# EAGLE design esp07_4PIO_6S_v2 (EAGLE 7.4.0)
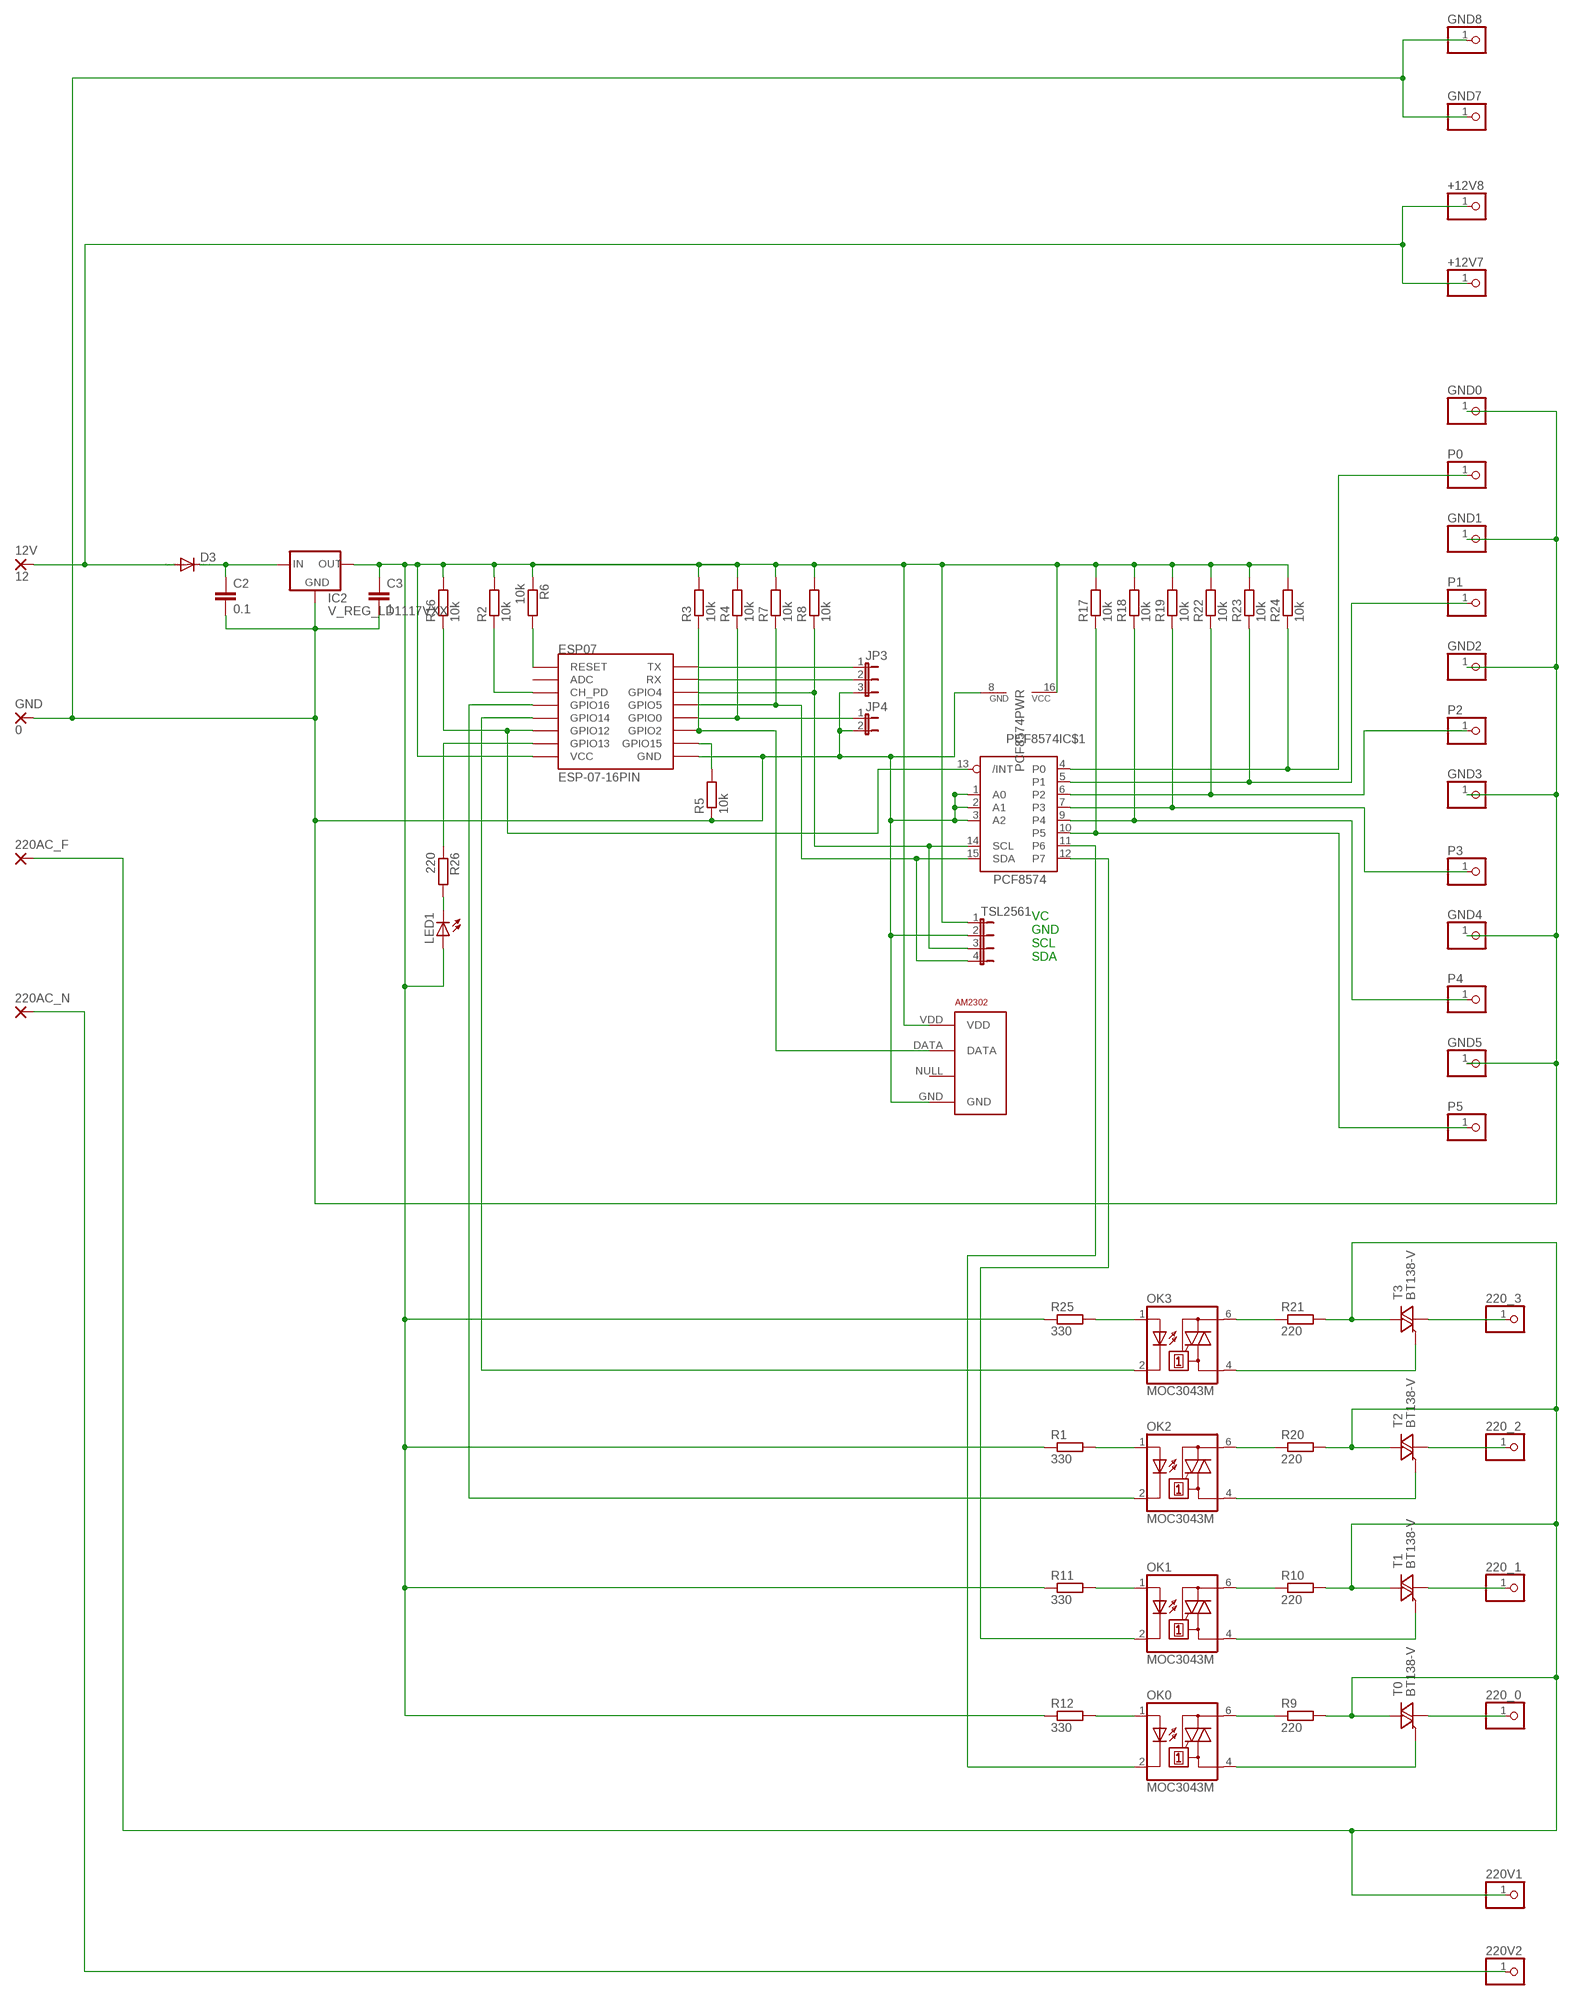
[diagram p0: schematic, sheet 1]

## Parts
12V  12  2,54/0,9  [2,54/0,9]
220_0  PINHD-1X1  [1X01]
220_1  PINHD-1X1  [1X01]
220_2  PINHD-1X1  [1X01]
220_3  PINHD-1X1  [1X01]
220AC_F  1,6/0,9  [1,6/0,9]
220AC_N  1,6/0,9  [1,6/0,9]
220V1  PINHD-1X1  [1X01]
220V2  PINHD-1X1  [1X01]
+12V7  PINHD-1X1  [1X01]
+12V8  PINHD-1X1  [1X01]
AM2302  RHT03_DHT-22_AM2302WIRED  [AM2302]
C2  0.1  C-EUC0805  [C0805]
C3  1  C-EUC1206  [C1206]
D3  DIODE-SOD80C  [SOD80C]
ESP07  ESP-07-16PIN  [ESP-07-16PIN]
GND  0  2,54/0,9  [2,54/0,9]
GND0  PINHD-1X1  [1X01]
GND1  PINHD-1X1  [1X01]
GND2  PINHD-1X1  [1X01]
GND3  PINHD-1X1  [1X01]
GND4  PINHD-1X1  [1X01]
GND5  PINHD-1X1  [1X01]
GND7  PINHD-1X1  [1X01]
GND8  PINHD-1X1  [1X01]
IC2  V_REG_LD1117VXX  [78XXL]
JP3  JP2E  [JP2]
JP4  JP1E  [JP1]
LED1  LEDCHIPLED_1206  [CHIPLED_1206]
OK0  MOC3043M  [DIL06]
OK1  MOC3043M  [DIL06]
OK2  MOC3043M  [DIL06]
OK3  MOC3043M  [DIL06]
P0  PINHD-1X1  [1X01]
P1  PINHD-1X1  [1X01]
P2  PINHD-1X1  [1X01]
P3  PINHD-1X1  [1X01]
P4  PINHD-1X1  [1X01]
P5  PINHD-1X1  [1X01]
PCF8574  PCF8574  [SOP16]
R1  330  R-EU_M1206  [M1206]
R2  10k  R-EU_R1206  [R1206]
R3  10k  R-EU_R1206  [R1206]
R4  10k  R-EU_R1206  [R1206]
R5  10k  R-EU_R1206  [R1206]
R6  10k  R-EU_R1206  [R1206]
R7  10k  R-EU_R1206  [R1206]
R8  10k  R-EU_R1206  [R1206]
R9  220  R-EU_M1206  [M1206]
R10  220  R-EU_M1206  [M1206]
R11  330  R-EU_M1206  [M1206]
R12  330  R-EU_M1206  [M1206]
R16  10k  R-EU_R1206  [R1206]
R17  10k  R-EU_R1206  [R1206]
R18  10k  R-EU_R1206  [R1206]
R19  10k  R-EU_R1206  [R1206]
R20  220  R-EU_M1206  [M1206]
R21  220  R-EU_M1206  [M1206]
R22  10k  R-EU_R1206  [R1206]
R23  10k  R-EU_R1206  [R1206]
R24  10k  R-EU_R1206  [R1206]
R25  330  R-EU_M1206  [M1206]
R26  220  R-EU_M1206  [M1206]
T0  BT138-V  [TO220BV]
T1  BT138-V  [TO220BV]
T2  BT138-V  [TO220BV]
T3  BT138-V  [TO220BV]
TSL2561  JP4E  [JP4]

## Nets
200V: 220AC_F.1(P) 220V1.1 R9.2 R10.2 R20.2 R21.2 T0.T2(A2) T1.T2(A2) T2.T2(A2) T3.T2(A2)
N$1: 12V.1(P) +12V7.1 +12V8.1 D3.A
N$3: OK3.1(A) R25.2
N$4: P0.1 PCF8574.4(IC$1:P0) R24.1
N$5: ESP07.TX JP3.1
N$6: ESP07.RX JP3.2
N$7: P1.1 PCF8574.5(IC$1:P1) R23.1
N$8: OK1.2(C) PCF8574.12(IC$1:P7)
N$9: P2.1 PCF8574.6(IC$1:P2) R22.1
N$10: ESP07.GPIO13 R26.1
N$11: ESP07.CH_PD R2.1
N$12: ESP07.REST(RESET) R6.2
N$13: P3.1 PCF8574.7(IC$1:P3) R19.1
N$14: OK0.2(C) PCF8574.11(IC$1:P6)
N$15: P4.1 PCF8574.9(IC$1:P4) R18.1
N$16: P5.1 PCF8574.10(IC$1:P5) R17.1
N$18: LED1.C R26.2
N$19: ESP07.GPIO14 OK3.2(C)
N$20: OK2.1(A) R1.2
N$21: OK1.1(A) R11.2
N$22: OK1.6(A2) R10.1
N$23: OK0.6(A2) R9.1
N$24: OK1.4(A1) T1.G
N$25: C2.1 D3.C IC2.OUT(IN)
N$26: OK0.4(A1) T0.G
N$27: 220_1.1 T1.T1(A1)
N$29: ESP07.GPIO4 PCF8574.14(IC$1:SCL) R8.1 TSL2561.3
N$30: 220_2.1 T2.T1(A1)
N$31: 220_0.1 T0.T1(A1)
N$32: AM2302.VDD C3.1 ESP07.VCC IC2.GND(OUT) LED1.A PCF8574.16(PWR:VCC) R1.1 R2.2 R3.2 R4.2 R6.1 R7.2 R8.2 R11.1 R12.1 R16.2 R17.2 R18.2 R19.2 R22.2 R23.2 R24.2 R25.1 TSL2561.1
N$33: OK0.1(A) R12.2
N$35: OK3.6(A2) R21.1
N$36: OK2.6(A2) R20.1
N$37: OK3.4(A1) T3.G
N$38: OK2.4(A1) T2.G
N$39: 220_3.1 T3.T1(A1)
N$40: ESP07.GPIO16 OK2.2(C)
N$41: 220AC_N.1(P) 220V2.1
N$42: ESP07.GPIO5 PCF8574.15(IC$1:SDA) R7.1 TSL2561.4
N$44: AM2302.GND C2.2 C3.2 ESP07.GND GND0.1 GND1.1 GND2.1 GND3.1 GND4.1 GND5.1 GND7.1 GND8.1 GND.1(P) IC2.IN(GND) JP3.3 JP4.2 PCF8574.1(IC$1:A0) PCF8574.2(IC$1:A1) PCF8574.3(IC$1:A2) PCF8574.8(PWR:GND) R5.1 TSL2561.2
N$45: ESP07.GPIO15 R5.2
N$46: ESP07.GPIO0 JP4.1 R4.1
N$47: AM2302.DATA ESP07.GPIO2 R3.1
N$48: ESP07.GPIO12 PCF8574.13(IC$1:/INT) R16.1
Unconnected: AM2302.NULL ESP07.ADC

## Notes on the sheet
- VC
  GND
  SCL
  SDA

## Library data of the parts
12V GND = wirepad:2,54/0,9: THROUGH-HOLE PAD
220_0 220_1-220_3 220V1 220V2 +12V7 +12V8 GND0 GND1-GND5 GND7 GND8 P0 P1-P5 = pinhead:PINHD-1X1: PIN HEADER
220AC_F 220AC_N = wirepad:1,6/0,9: THROUGH-HOLE PAD
AM2302 = RHT03_DHT-22_AM2302:RHT03_DHT-22_AM2302: RHT03 / DHT-22 / AM2302 Packages and symbol for the RHT03 / DHT-22 relative humidity and temperature sensor. Note: The AM2302 is a wired version of the DHT-22 which typically requires less clearance and is thus provided as a separate package.; PROD_ID: SEN-10167
C2 C3 = rcl:C-EU: CAPACITOR, European symbol
D3 = diode:DIODE-: DIODE
ESP07 = esp8266modules:ESP-07-16PIN: ESP8266 Wifi Module ESP-07 - 16 pins; DIMENSIONS: 22.0 x 16.0 mm; PINS: 16; PITCH: 0.078" / 2 mm
IC2 = SparkFun:V_REG_LD1117VXX: LD1117VXX voltage regulator. We carry the 3.3V version (COM-00526) in TO-220 package.
JP3 = jumper:JP2E: JUMPER
JP4 = jumper:JP1E: JUMPER
LED1 = led:LED: LED OSRAM: - CHIPLED LG R971, LG N971, LY N971, LG Q971, LY Q971, LO R971, LY R971 LH N974, LH R974 LS Q976, LO Q976, LY Q976 LO Q996 - Hyper CHIPLED LW Q18S LB Q993, LB Q99A, LB R99A - SideLED LS A670, LO A670, LY A670, LG A670, LP A670 LB A673, LV A673, LT A673, LW A673 LH A674 LY A675 LS A676, LA A676, LO A676, LY A676, LW A676 LS A679, LY A679, LG A679 - Hyper Micro SIDELED® LS Y876, LA Y876, LO Y876, LY Y876 LT Y87S - SmartLED LW L88C, LW L88S LB L89C, LB L89S, LG L890 LS L89K, LO L89K, LY L89K LS L896, LA L896, LO L896, LY L896 - TOPLED LS T670, LO T670, LY T670, LG T670, LP T670 LSG T670, LSP T670, LSY T670, LOP T670, LYG T670 LG T671, LOG T671, LSG T671 LB T673, LV T673, LT T673, LW T673 LH T674 LS T676, LA T676, LO T676, LY T676, LB T676, LH T676, LSB T676, LW T676 LB T67C, LV T67C, LT T67C, LS T67K, LO T67K, LY T67K, LW E67C LS E67B, LA E67B, LO E67B, LY E67B, LB E67C, LV E67C, LT E67C LW T67C LS T679, LY T679, LG T679 LS T770, LO T770, LY T770, LG T770, LP T770 LB T773, LV T773, LT T773, LW T773 LH T774 LS E675, LA E675, LY E675, LS T675 LS T776, LA T776, LO T776, LY T776, LB T776 LHGB T686 LT T68C, LB T68C - Hyper Mini TOPLED® LB M676 - Mini TOPLED Santana® LG M470 LS M47K, LO M47K, LY M47K Source: http://www.osram.convergy.de LUXEON: - LUMILED® LXK2-PW12-R00, LXK2-PW12-S00, LXK2-PW14-U00, LXK2-PW14-V00 LXK2-PM12-R00, LXK2-PM12-S00, LXK2-PM14-U00 LXK2-PE12-Q00, LXK2-PE12-R00, LXK2-PE12-S00, LXK2-PE14-T00, LXK2-PE14-U00 LXK2-PB12-K00, LXK2-PB12-L00, LXK2-PB12-M00, LXK2-PB14-N00, LXK2-PB14-P00, LXK2-PB14-Q00 LXK2-PR12-L00, LXK2-PR12-M00, LXK2-PR14-Q00, LXK2-PR14-R00 LXK2-PD12-Q00, LXK2-PD12-R00, LXK2-PD12-S00 LXK2-PH12-R00, LXK2-PH12-S00 LXK2-PL12-P00, LXK2-PL12-Q00, LXK2-PL12-R00 Source: www.luxeon.com KINGBRIGHT: KA-3528ASYC Source: www.kingbright.com
OK0 OK1-OK3 = optocoupler:MOC30*: 6-Pin DIP Zero-Cross Optoisolators Triac Driver Output (250/400 Volt Peak) Source: Data sheet <http://www.fairchildsemi.com/ds/MO/MOC3031M.pdf> The old path of data sheet not more available 2013-05-06.; MF: FAIRCHILD SEMICONDUCTOR; MPN: MOC3043-M; OC_FARNELL: 1021371; OC_NEWARK: 72K8900
PCF8574 = i2c:PCF8574: Remote 8-Bit I/O Expander for I²C Bus
R1 R9-R12 R20 R21 R25 R26 = rcl:R-EU_: RESISTOR, European symbol
R2-R8 R16-R19 R22-R24 = resistor:R-EU_: RESISTOR, European symbol
T0 T1-T3 = triac:BT138: TRIAC Source: http://www.semiconductors.philips.com BT138_SERIES_2.pdf
TSL2561 = jumper:JP4E: JUMPER

## Board
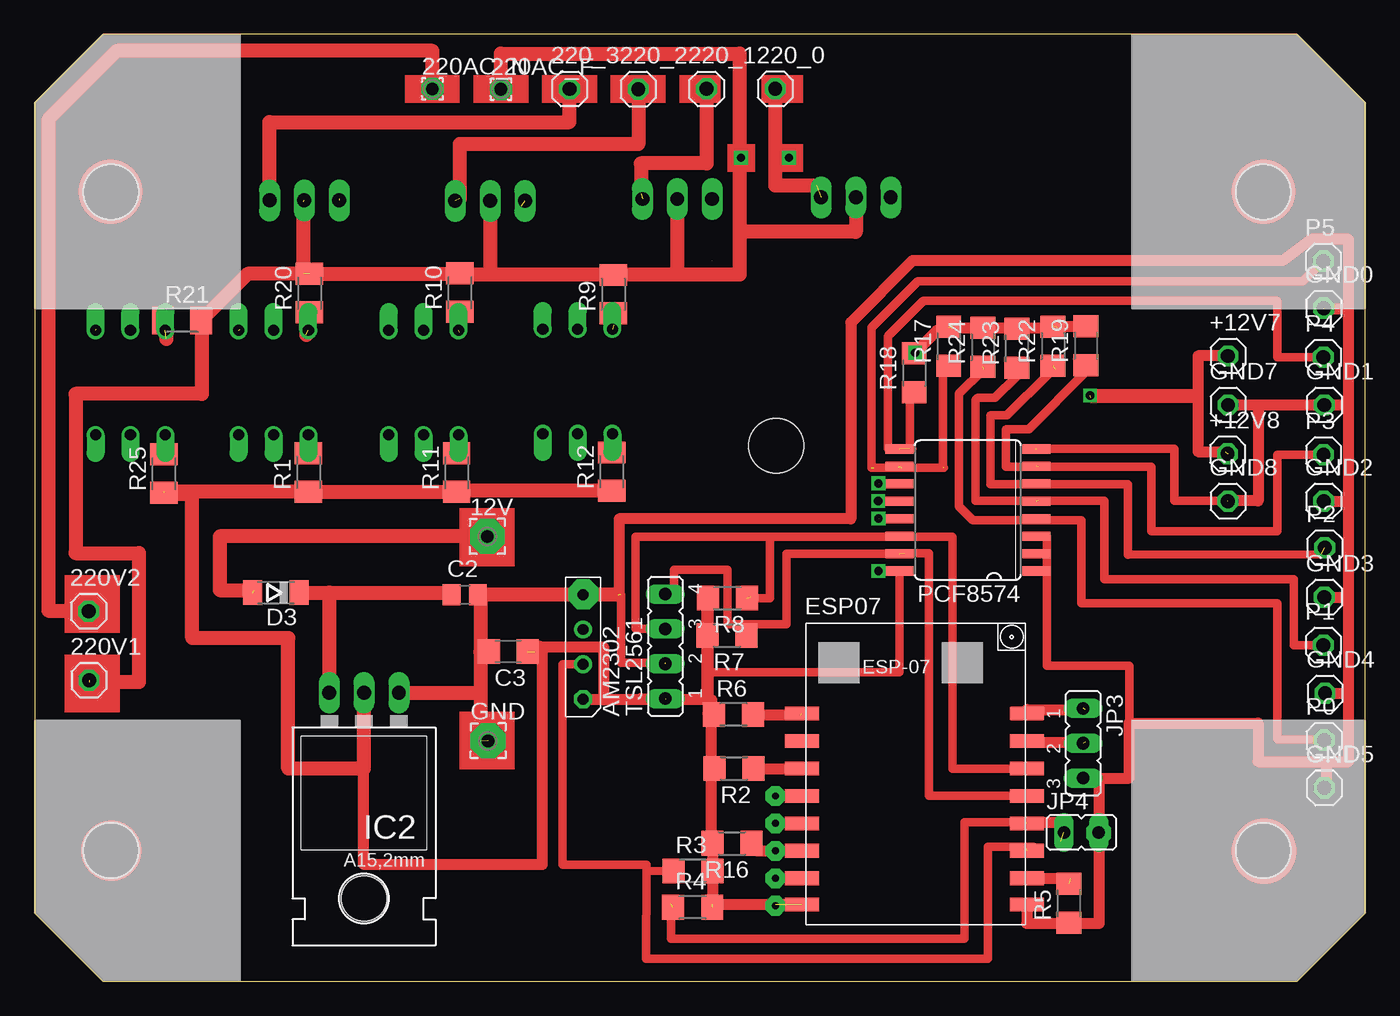
[diagram p1: board, top side]
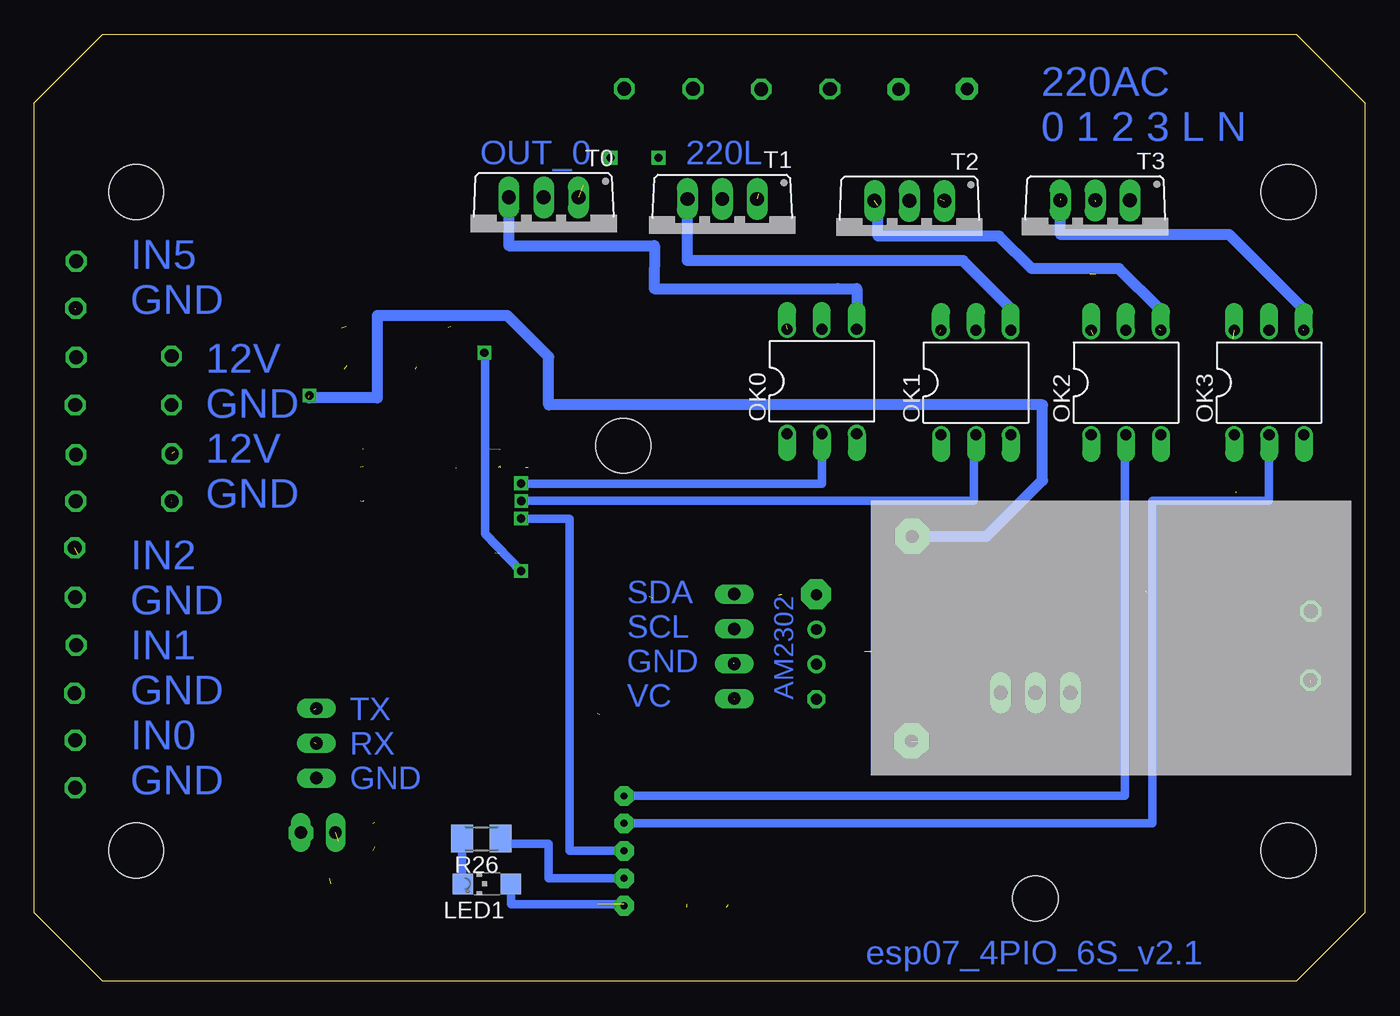
[diagram p2: board, bottom side, seen from below]

Size 97 x 69 mm. Coordinates in mm from the lower left corner, seen from the top.
Outline: 0,5 5,0 92,0 92,0 97,5 97,64 92,69 5,69 0,64 0,64 0,5
Copper layers (1*16): Top 0.035mm / dielectric 1.5mm / Bottom 0.035mm
Design rules "default": minimum track width 10mil, minimum drill 24mil, track to track 8mil, track to pad 8mil, pad to pad 8mil, via to via 8mil, smd to smd 8mil, copper to edge 40mil, drill to drill 8mil, minimum pad ring 10mil, minimum via ring 8mil, stop-mask expansion 4mil, vias tented up to drill 0mil, thermal gap 10mil
Holes 4 mm at 5.57,57.52 89.57,57.52 89.57,9.52 5.57,9.52 54.07,39.02

### Footprints (pad centres in the part's own frame; a part is rotated, then mirrored left to right if it is on the bottom)
2,54/0,9 = drill 0.914 pad 2.54 octagon: 1 0,0
1X01 = drill 1.016 octagon: 1 0,0
1,6/0,9 = drill 0.914 pad 1.6 octagon: 1 0,0
AM2302 = drill 0.8: DATA -1.27,0; GND 3.81,0; NULL 1.27,0 | drill 0.8 octagon: VDD -3.81,0
C0805 = smd 1.3 x 1.5: 1 -0.95,0; 2 0.95,0
C1206 = smd 1.6 x 1.8: 1 -1.4,0; 2 1.4,0
SOD80C = smd 1.4 x 1.8: A 1.7,0; C -1.7,0
ESP-07-16PIN = smd 2.5 x 1: ADC -8.2,3.8; CH_PD -8.2,1.8; GND 8.2,-8.105; GPIO0 8.2,-2.2; GPIO2 8.2,-4.2; GPIO4 8.2,1.8; GPIO5 8.2,-0.2; GPIO12 -8.2,-4.2; GPIO13 -8.2,-6.2; GPIO14 -8.2,-2.2; GPIO15 8.2,-6.2; GPIO16 -8.2,-0.2; REST -8.2,5.8; RX 8.2,3.8; TX 8.2,5.8; VCC -8.2,-8.105
78XXL = drill 1.016 long: GND 0,-3.81; IN -2.54,-3.81; OUT 2.54,-3.81 | hole 3.302: 0,11.176
JP2 = drill 0.914 long: 1 -2.54,0; 2 0,0; 3 2.54,0
JP1 = drill 0.914 long: 1 0,-1.27; 2 0,1.27
CHIPLED_1206 = smd 1.5 x 1.5: A 0,-1.75; C 0,1.75
DIL06 = drill 0.813 offset: 1 -2.54,-3.81; 2 0,-3.81; 3 2.54,-3.81; 4 2.54,3.81; 5 0,3.81; 6 -2.54,3.81
SOP16 = smd 0.66 x 2.032: 1 -4.029,-1.136; 2 -2.759,-1.136; 3 -1.489,-1.136; 4 -0.219,-1.136; 5 1.051,-1.136; 6 2.321,-1.136; 7 3.591,-1.136; 8 4.861,-1.136; 9 4.861,8.821; 10 3.591,8.821; 11 2.321,8.821; 12 1.051,8.821; 13 -0.219,8.821; 14 -1.489,8.821; 15 -2.759,8.821; 16 -4.029,8.821
M1206 = smd 1.6 x 2: 1 -1.4,0; 2 1.4,0
R1206 = smd 1.6 x 1.803: 1 -1.422,0; 2 1.422,0
TO220BV = drill 1.016 long: G 2.54,-2.54; T1 -2.54,-2.54; T2 0,-2.54
JP4 = drill 0.914 long: 1 -3.81,0; 2 -1.27,0; 3 1.27,0; 4 3.81,0

### Placement (x,y rotation side)
12V  33.01,32.41 0 top
220_0  53.99,65.03 0 top
220_1  48.99,65.02 0 top
220_2  44.01,65.01 0 top
220_3  39.01,65.01 0 top
220AC_F  34,65 0 top
220AC_N  29,65.02 0 top
220V1  3.97,21.93 0 top
220V2  3.94,26.96 0 top
+12V7  87,45.56 0 top
+12V8  86.97,38.43 0 top
AM2302  39.99,24.36 90 top
C2  31.36,28.16 0 top
C3  34.53,24.02 180 top
D3  17.6,28.32 180 top
ESP07  64.14,13.7 0 top
GND  33.06,17.52 0 top
GND0  93.97,49.04 0 top
GND1  94.02,41.99 0 top
GND2  93.97,34.99 0 top
GND3  94.02,27.99 0 top
GND4  94.07,20.99 0 top
GND5  94.02,14.09 0 top
GND7  87,41.99 0 top
GND8  87,34.98 0 top
IC2  24.02,17.21 180 top
JP3  76.45,17.34 270 top
JP4  76.31,10.84 270 top
LED1  64,7.1 90 bottom
OK0  39.59,43.71 0 bottom
OK1  28.36,43.62 0 bottom
OK2  17.42,43.62 0 bottom
OK3  6.99,43.62 0 bottom
P0  94.01,17.56 0 top
P1  93.95,24.49 0 top
P2  94.04,31.59 0 top
P3  93.96,38.37 0 top
P4  93.95,45.47 0 top
P5  93.94,52.47 0 top
PCF8574  71.88,33.92 90 top
R1  19.97,37.08 90 top
R2  50.98,15.5 180 top
R3  47.99,8.03 0 top
R4  47.98,5.39 0 top
R5  75.39,5.68 90 top
R6  50.97,19.43 0 top
R7  50.48,25.19 180 top
R8  50.51,27.92 180 top
R9  42.19,50.06 90 top
R10  30.99,50.18 90 top
R11  30.77,37.06 90 top
R12  42.07,37.13 90 top
R16  50.83,10.05 180 top
R17  66.64,46.28 90 top
R18  64.12,44.32 90 top
R19  76.64,46.32 90 top
R20  20.04,50.14 90 top
R21  10.76,48.16 0 top
R22  74.24,46.28 90 top
R23  71.6,46.14 90 top
R24  69.13,46.21 90 top
R25  9.42,36.98 90 top
R26  64.4,10.4 180 bottom
T0  59.87,54.58 180 bottom
T1  46.85,54.46 180 bottom
T2  33.21,54.32 180 bottom
T3  19.67,54.36 180 bottom
TSL2561  45.98,24.41 90 top

### Tracks (layer width: path | path; a pad name or v marks a point on that pad's centre or on a via)
200V  (3 unrouted)
  Top 1.016: 220AC_F.1 34,67.6 51.4,67.6 51.4,54.6 | 51.4,54.6 51.4,51.5 46.85,51.5 | R9.2 42.19,51.5 | 42.19,51.5 46.85,51.5 | R10.2 30.99,51.5 31.5,51.5 | 31.5,51.5 33.21,51.5 | 33.21,51.5 42.19,51.5 | T1.T2 46.85,51.5 | T2.T2 33.21,51.5 | 19.6,56.8 19.6,51.54 15.54,51.54 12.2,48.2 | R21.2 12.2,48.2 | T0.T2 59.87,54.6 51.4,54.6 | 12.2,48.2 12.2,42.8 3,42.8 3,31.2 7.6,31.2 7.6,21.8 4,21.8 | R20.2 31.5,51.54 31.5,51.5
N$1  (via drill 0.6)  (3 unrouted)
  Top 0.813: +12V7.1 84.8,45.56 84.8,42.5 | 84.8,42.5 84.8,38.6 86.8,38.6 | 84.55,42.67 84.55,42.5 84.8,42.5
  Top 1.016: v76.95,42.67 84.55,42.67 | 12V.1 13.5,32.41 13.5,28.5 16,28.5
  Bottom 0.813: 12V.1 27.59,32.41 23.5,36.5 23.5,42 59.5,42 59.5,45.5 62.5,48.5 72,48.5 72,42.5 77,42.5
N$2  (via drill 0.6)
  other vias: 64.2,45.8
N$3
  Top 0.813: OK3.1 9.53,38.38 R25.2
N$4  (1 unrouted)
  Top 0.61: 69.2,44.6 67.4,42.8 67.4,34.6 68.4,33.6 73.02,33.6 | 94.01,17.6 90.59,17.64 90.59,27.54 76.3,27.56 76.3,33.6 73.02,33.6 | PCF8574.4 73.02,33.6
  Top 0.813: P0.1 94.01,17.6
N$5  (1 unrouted)
  Top 0.813: ESP07.TX 72.34,19.8 76.6,19.8
N$6  (1 unrouted)
  Top 0.813: ESP07.RX 72.34,17.4 76.6,17.4
N$7  (2 unrouted)
  Top 0.61: P1.1 91.8,24.49 91.8,29.28 78,29.29 78,35 73.2,35 | 73,35 68.6,35 68.6,42.32 68.78,42.5 70,42.5 71.6,44.1 R23.1
N$8  (via drill 0.6)
  Top 0.61: PCF8574.12 61.5,34.97 v61.5,35
  Bottom 0.61: OK1.2 28.5,39.81 28.5,35 v61.5,35
N$9  (2 unrouted)
  Top 0.61: 93.8,31.1 79.7,31.09 79.7,36.2 73.8,36.2 | 73.8,36.2 69.68,36.2 69.68,41.2 69.71,41.23 70.89,41.23 73.9,44.24 74.4,44.6 | PCF8574.6 73.8,36.24 73.8,36.2
N$10  (via drill 0.5 pad 1.42)
  Top 0.61: ESP07.GPIO13 v54,7.5
  Bottom 0.61: R26.1 63,10 59.5,10 59.5,7.5 55.5,7.5 v54,7.5
N$11
  Top 0.813: R2.1 ESP07.CH_PD
N$12  (1 unrouted)
  Top 0.813: R6.2 55.63,19.4 55.8,19.4
N$13  (1 unrouted)
  Top 0.61: P3.1 90.6,38.37 90.6,32.8 81.4,32.8 81.4,37.48 73.2,37.48 70.8,37.5 70.8,40.2 70.84,40.24 72.47,40.24 76.6,44.37 76.6,44.9 R19.1
N$14  (1 unrouted)
  Top 0.61: PCF8574.11 61.56,36.24
  Bottom 0.61: OK0.2 39.59,36.24 61.56,36.24
N$15  (1 unrouted)
  Top 0.61: P4.1 90.6,45.47 90.6,49.6 64.8,49.6 62.2,47 62.2,38.8 63.8,38.8 | 64,38.8 63.8,38.8 | R18.1 63.8,42.58 63.8,38.8
N$16  (4 unrouted)
  Top 0.61: 66.28,37.43 63.2,37.43 | 61.2,37.4 63,37.4 | R17.1 66.2,44.42 66.2,37.4 | 61,37.4 61,47.6 64.4,51 80,51 80.03,51 92.47,51 P5.1
N$17  (via drill 0.6)
  other vias: 51.5,60
N$18
  Bottom 0.61: LED1.C 65.8,7.1 R26.2
N$19  (via drill 0.5 pad 1.42)
  Top 0.61: ESP07.GPIO14 v54,11.5
  Bottom 0.61: OK3.2 7,35 15.5,35 15.5,11.5 v54,11.5
N$20
  Top 0.813: OK2.1 R1.2
N$21
  Top 0.813: OK1.1 30.9,38.46 R11.2
N$22  (1 unrouted)
  Top 1.016: R10.1 31,47.3
N$23  (1 unrouted)
  Top 1.016: R9.1 42.2,48.16 42.2,47.8
N$24  (1 unrouted)
  Bottom 0.813: OK1.4 25.81,49 29.31,52.5 49.4,52.5 | 49.39,52.51 T1.G
N$25
  Top 1.016: D3.C 21.5,28.32 | 21.5,28.32 30.41,28.32 C2.1 | IC2.OUT 21.5,21.02 21.5,28.32
N$26
  Bottom 0.813: T0.G 62.41,53.6 51.8,53.6 51.82,50.47 38.45,50.47 37.05,50.47 OK0.4
N$27  (1 unrouted)
  Top 1.016: 220_1.1 48.99,59.6 44.2,59.6 44.2,57.4
N$28
  Top 1.016: 13.5,28.5 16,28.5
N$29  (1 unrouted)
  Top 0.61: ESP07.GPIO4 66.9,15.5 66.9,32.4 63.06,32.4 | TSL2561.3 43.8,25.68 43.8,32.4 53.6,32.4 | 52.6,28 52.2,28 | 63.06,32.4 53.6,32.4 | 53.6,32.4 53.6,27.92 R8.1 | PCF8574.14 63.06,32.4
N$30  (1 unrouted)
  Top 1.016: 220_2.1 44.01,61 31,61 31,57
N$31  (1 unrouted)
  Top 1.016: 220_0.1 53.99,58 57,58
N$32  (via drill 0.6)  (8 unrouted)
  Top 0.61: 49.09,22.5 63.06,22.5 PCF8574.16 v61.52,29.89 | R3.2 49.47,8.03 49.5,8 49.41,8
  Top 0.813: AM2302.VDD 46,20.55 | 46,20.55 44.2,20.6 | R18.2 65.78,47.4 66.6,47.4 66.83,47.63 R24.2 69.16,47.6 71.4,47.6 71.44,47.56 R23.2 71.64,47.6 74.6,47.6 | R22.2 74.28,47.74 R19.2 | ESP07.VCC 49.41,5.59 49.41,8 R16.2 49.37,10.55 49.37,15.5 | 49.37,15.5 49.37,19.5 | 49,20.5 49.37,20.5 49.37,19.5 | 49.09,25 R8.2 49,27.92 49,20.5 | 49.09,25 49.09,22.5 49.09,19.5 49.37,19.5 | R2.2 | 49.5,16 49.56,16 R2.2 | 49.5,19.5 49.5,20 | 49.37,19.5 49.5,19.5 | 49.5,19.5 49.5,19.43 R6.1 | R2.2 49.37,15.5 | R7.2 49.06,25 49.09,25 | 49,20.5 46,20.5 | 46,20.5 46,20.55 | 46,20.5 41.5,20.5 41.5,24.33 37,24.33 | 37,24.33 37,8.5 24,8.5 24,16 | 37,24.33 36.5,24.5 36.5,24
  Top 1.016: 9.42,35.68 R1.1 30.77,35.68 R11.1 30.77,35.73 R12.1 | IC2.GND 24,21.02 24,16 24,15.5 18.5,15.5 18.5,25 11.5,25 11.5,35.5 9.42,35.5 R25.1
  Bottom 0.61: LED1.A 62.25,5.59 54,5.59 | R18.2 64.12,32.62 v61.52,29.89
  Bottom 0.813: 64.19,45.81 R18.2
N$33
  Top 0.813: OK0.1 42.13,38.53 R12.2
N$34  (via drill 0.6)
  other vias: 55,60
N$35  (1 unrouted)
  Top 1.016: R21.1 9.6,48.16 9.6,46.8
N$36  (1 unrouted)
  Top 1.016: R20.1 19.8,48.74 19.8,47.1
N$37  (2 unrouted)
  Bottom 0.813: 22.2,57 22.2,54.4 9.9,54.4 4.5,49 4.5,47.5
N$38  (2 unrouted)
  Bottom 0.813: 35.5,56.5 35.5,54.3 26.67,54.3 24.3,51.93 17.93,51.93 15,49 15,47.5
N$39
  Top 1.016: T3.T1 17.13,62.6 39,62.6 220_3.1
N$40  (via drill 0.5 pad 1.42)
  Top 0.61: ESP07.GPIO16 v54,13.5
  Bottom 0.61: OK2.2 17.5,39.81 17.5,13.5 v54,13.5
N$41
  Top 1.016: 220AC_N.1 29,67 29,67.8 6,67.8 1,62.8 1,27 3.9,27 220V2.1
N$42  (1 unrouted)
  Top 0.61: ESP07.GPIO5 65.2,13.5 65.2,31.2 63.4,31.2 | PCF8574.15 54.8,31.16 54.8,26 51.9,26 | 51.9,26 R7.1 | TSL2561.4 46.6,28.22 46.6,30 50.51,30 50.51,26 51.9,26
N$43  (via drill 0.6)
  other vias: 61.52,33.72
N$44  (7 unrouted)
  Top 0.406: PCF8574.1 73.8,29.89 73.8,30
  Top 0.61: 42.75,28.17 42.75,23.2 46,23.2 | 73.04,38.8 83.1,38.8 83.1,35 87,35 | 94.2,14.2 94,14.2 | PCF8574.3 73.02,32.4 73.8,32.4 73.8,31.2 | 73.8,31.2 73.8,30 73.8,23 79.8,23 79.8,18.8 | PCF8574.2 73.02,31.2 73.8,31.2
  Top 0.813: JP3.3 77.6,14.8 | 77.6,14.8 77.6,10.22 | 77.6,10.22 77.6,4.2 75,4.2 | 75,4.2 72.34,4.2 ESP07.GND | JP4.2 77.6,10.22 | 77.6,14.8 79.8,14.8 79.8,18.8 89.2,18.8 89.2,16 94.2,16 | 94.2,16 95.8,16 95.8,21 | 95.8,21 95.8,27.99 | 95.8,27.99 95.8,34.99 | 95.8,34.99 95.8,41.99 | 95.8,41.99 95.8,49 | GND1.1 94.2,41.99 | 94.2,41.99 95.8,41.99 | GND2.1 95.8,34.99 | GND3.1 95.8,27.99 | GND4.1 95.8,21 | GND5.1 94.02,14.2 94.2,14.2 94.2,16 | 75,4.6 75,4.26 R5.1 75.39,4 75,4 75,4.2 | 94.2,41.99 GND7.1 89.2,41.99 89.2,35 87,35 | 94.2,41.99 | 94,49 95.8,49 | 95.8,49 95.8,54.06 93.06,54.06 91,52.5 64,52.5 59.5,48 59.5,33.69 42.62,33.69 42.62,28.17 | 32.5,17.5 32,17.5 | C3.2 32.5,24.02 32.5,24
  Top 1.016: 42.5,28.17 AM2302.GND C2.2 32.5,28.16 32.5,24 32.5,21.02 | IC2.IN 32.5,21.02 | 32.5,21.02 32.5,17.5
N$45  (1 unrouted)
  Top 0.813: ESP07.GPIO15 75.5,7.5
N$46  (3 unrouted)
  Top 0.61: 72.2,11.6 67.8,11.6 67.8,3.1 46.4,3.1 46.4,5.6
  Top 0.813: 72.2,11.6 74.8,11.6 74.8,10.2
N$47  (1 unrouted)
  Top 0.61: 72.8,9.8 72.2,9.8 | 72.2,9.8 72,9.6 | 72.2,9.8 69.5,9.8 69.49,1.63 44.59,1.63 44.6,8.02 | 44.6,8.02 R3.1 | 44.6,8.02 44.6,8.5 38.5,8.5 38.5,23.09 AM2302.DATA
N$48  (via drill 0.5 pad 1.42)  (1 unrouted)
  Top 0.61: ESP07.GPIO12 v54,9.5 | PCF8574.13 61.56,33.7
  Top 0.813: R16.1 52.68,9.49 v54,9.5
  Bottom 0.61: v54,9.5 58,9.5 58,33.7 61.56,33.7
N$49  (via drill 0.6)
  other vias: 61.52,36.28
N$50  (via drill 0.5 pad 1.42)
  other vias: 54,5.5
N$52  (via drill 0.5 pad 2.18)
  other vias: 40.01,28.2
N$53  (via drill 0.5 pad 1.78)
  other vias: 77.57,10.8
(copper drawn outside any net)
  shapes: Top area x12, Top circle x4

### Text on the board
Bottom: 220AC / 0 1 2 3 L N | 220L | OUT_0 | IN5 / GND | 12V / GND / 12V / GND | AM2302 | SDA / SCL / GND / VC | TX / RX / GND | IN2 / GND / IN1 / GND / IN0 / GND | esp07_4PIO_6S_v2.1